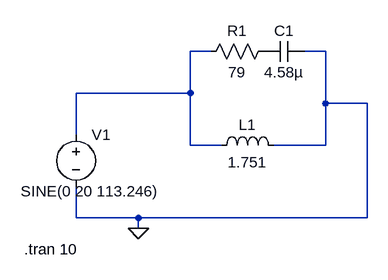
[diagram p0: schematic 1.asc]
1.asc, the LTspice schematic file:
Version 4
SHEET 1 880 680
WIRE 304 -16 272 -16
WIRE 480 -16 448 -16
WIRE 272 48 272 -16
WIRE 272 48 96 48
WIRE 480 64 480 -16
WIRE 544 64 480 64
WIRE 96 112 96 48
WIRE 272 128 272 48
WIRE 320 128 272 128
WIRE 480 128 480 64
WIRE 480 128 400 128
WIRE 96 240 96 192
WIRE 192 240 96 240
WIRE 544 240 544 64
WIRE 544 240 192 240
WIRE 192 256 192 240
FLAG 192 256 0
SYMBOL voltage 96 96 R0
WINDOW 3 -85 103 Left 2
WINDOW 123 0 0 Left 0
WINDOW 39 0 0 Left 0
SYMATTR Value SINE(0 20 113.246)
SYMATTR InstName V1
SYMBOL ind 304 144 R270
WINDOW 0 32 56 VTop 2
WINDOW 3 5 56 VBottom 2
SYMATTR InstName L1
SYMATTR Value 1.751
SYMATTR SpiceLine Rser=24
SYMBOL res 400 -32 R90
WINDOW 0 0 56 VBottom 2
WINDOW 3 32 56 VTop 2
SYMATTR InstName R1
SYMATTR Value 79
SYMBOL cap 448 -32 R90
WINDOW 0 0 32 VBottom 2
WINDOW 3 32 32 VTop 2
SYMATTR InstName C1
SYMATTR Value 4.58µ
TEXT 16 288 Left 2 !.tran 10

The netlist it stands for:
* 1.asc
V1 N001 0 SINE(0 20 113.246)
L1 N001 0 1.751 Rser=24
R1 P001 N001 79
C1 0 P001 4.58µ
.tran 10
.backanno
.end